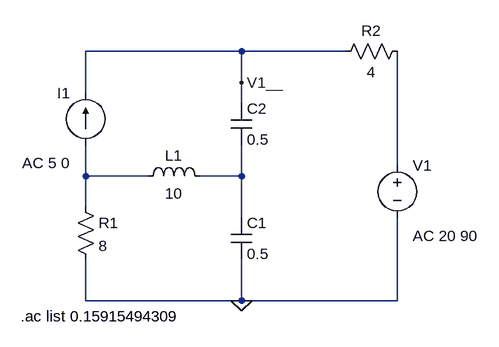
[diagram p0: schematic Draft3.asc]
Draft3.asc, the LTspice schematic file:
Version 4
SHEET 1 880 680
WIRE 368 -32 128 -32
WIRE 528 -32 368 -32
WIRE 368 16 368 -32
WIRE 128 32 128 -32
WIRE 368 48 368 16
WIRE 608 144 608 -32
WIRE 128 160 128 112
WIRE 224 160 128 160
WIRE 368 160 368 112
WIRE 368 160 304 160
WIRE 128 208 128 160
WIRE 368 224 368 160
WIRE 128 352 128 288
WIRE 368 352 368 288
WIRE 368 352 128 352
WIRE 608 352 608 224
WIRE 608 352 368 352
FLAG 368 352 0
FLAG 368 16 V1__
SYMBOL current 128 112 R180
WINDOW 0 24 80 Left 2
WINDOW 3 24 0 Left 2
WINDOW 123 24 -28 Left 2
WINDOW 39 0 0 Left 0
SYMATTR InstName I1
SYMATTR Value ""
SYMATTR Value2 AC 5 0
SYMBOL res 112 192 R0
SYMATTR InstName R1
SYMATTR Value 8
SYMBOL cap 352 224 R0
SYMATTR InstName C1
SYMATTR Value 0.5
SYMBOL cap 352 48 R0
SYMATTR InstName C2
SYMATTR Value 0.5
SYMBOL res 624 -48 R90
WINDOW 0 0 56 VBottom 2
WINDOW 3 32 56 VTop 2
SYMATTR InstName R2
SYMATTR Value 4
SYMBOL ind 320 176 M270
WINDOW 0 32 56 VTop 2
WINDOW 3 5 56 VBottom 2
SYMATTR InstName L1
SYMATTR Value 10
SYMBOL voltage 608 128 R0
WINDOW 123 24 124 Left 2
WINDOW 39 0 0 Left 0
SYMATTR InstName V1
SYMATTR Value ""
SYMATTR Value2 AC 20 90
TEXT 28 376 Left 2 !.ac list 0.15915494309

The netlist it stands for:
* Draft3.asc
I1 N002 V1__ AC 5 0
R1 N002 0 8
C1 N003 0 0.5
C2 V1__ N003 0.5
R2 N001 V1__ 4
L1 N003 N002 10
V1 N001 0 AC 20 90
.ac list 0.15915494309
.backanno
.end